# EAGLE design R202X (EAGLE 6.6.0)
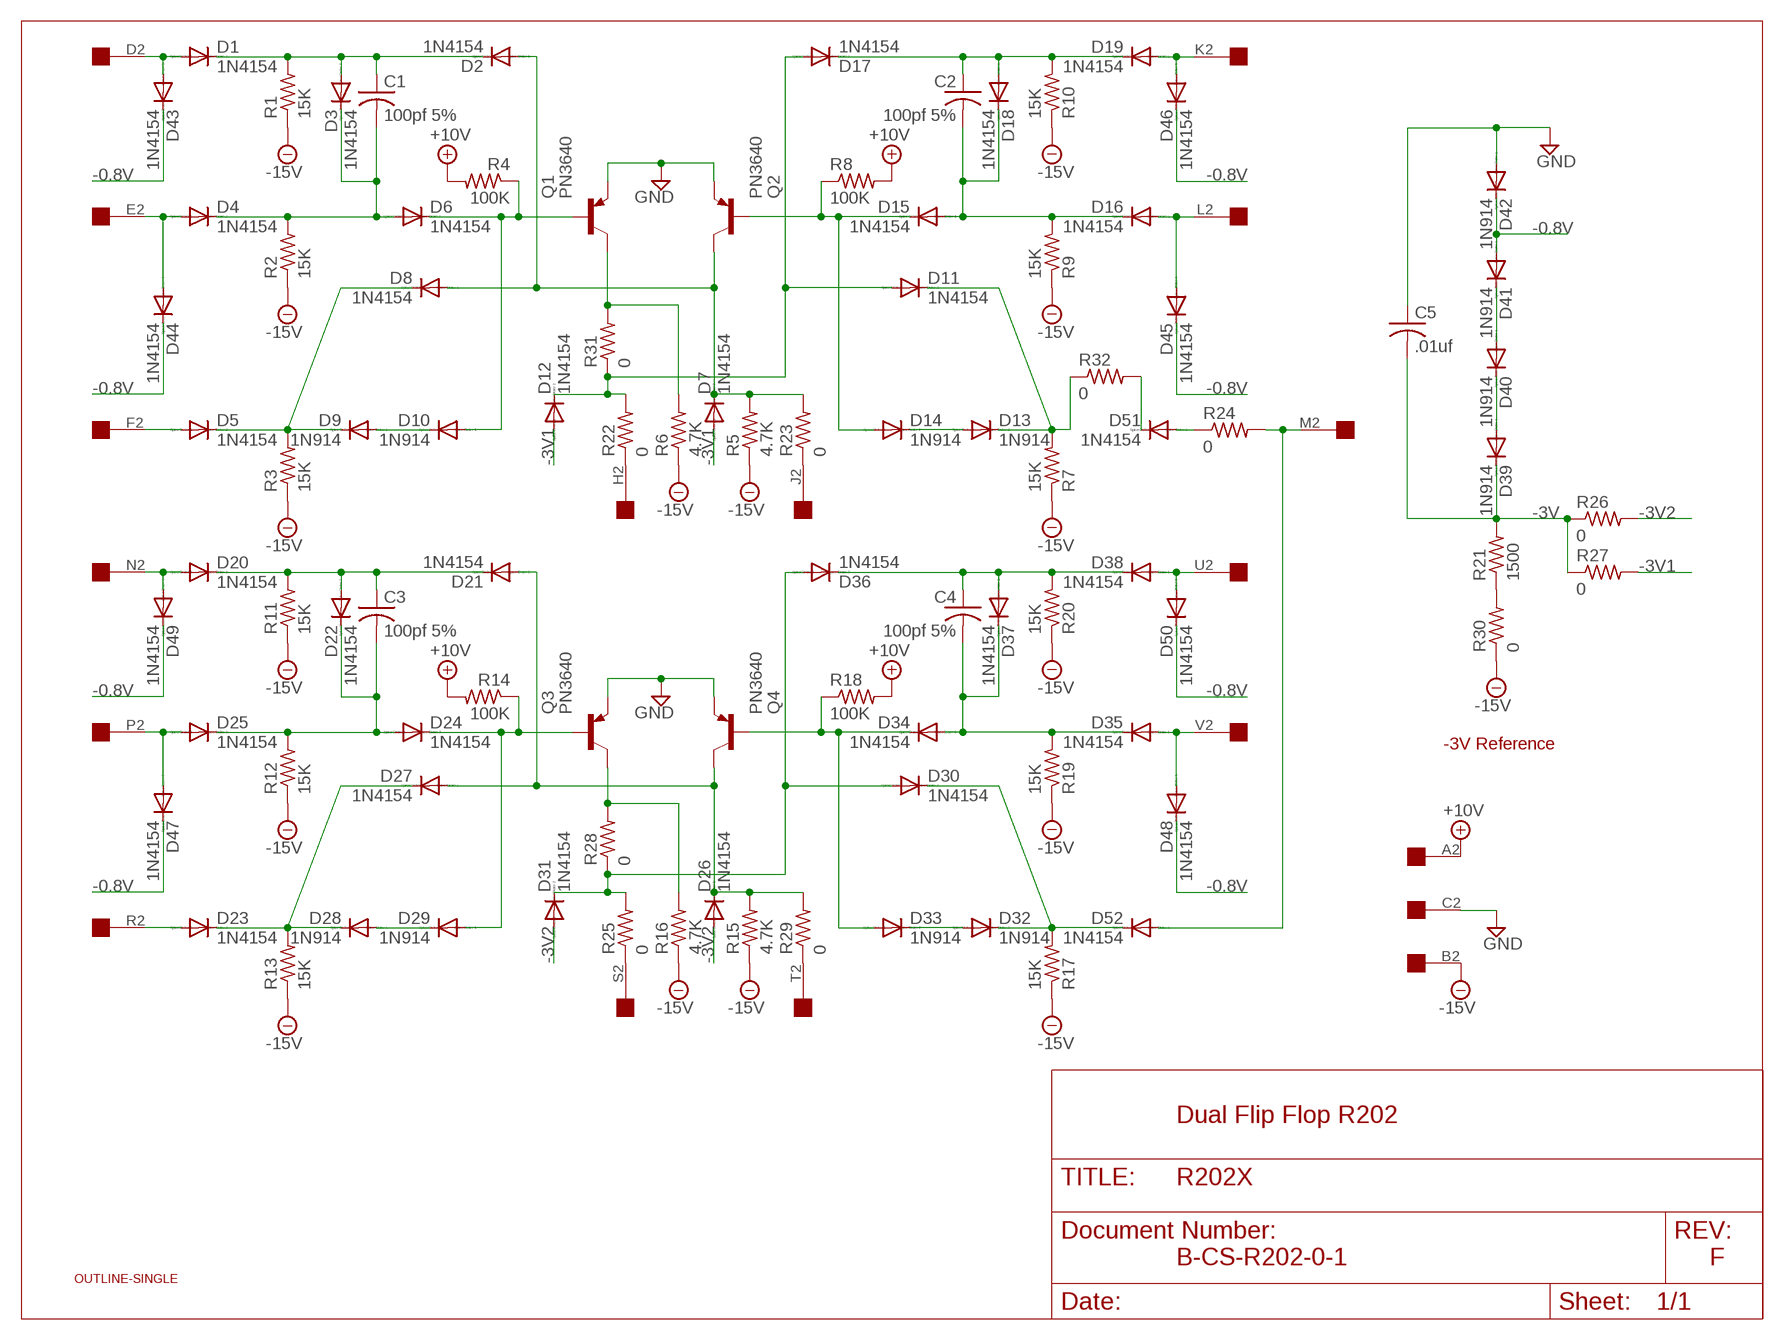
[diagram p0: schematic, sheet 1]

## Parts
C1  100pf 5%  C-US050-025X075  [C050-025X075]
C2  100pf 5%  C-US050-025X075  [C050-025X075]
C3  100pf 5%  C-US050-025X075  [C050-025X075]
C4  100pf 5%  C-US050-025X075  [C050-025X075]
C5  .01uf  C-US050-025X075  [C050-025X075]
D1  1N4154  1N4148DO35-10  [DO35-10]
D2  1N4154  1N4148DO35-10  [DO35-10]
D3  1N4154  1N4148DO35-10  [DO35-10]
D4  1N4154  1N4148DO35-10  [DO35-10]
D5  1N4154  1N4148DO35-10  [DO35-10]
D6  1N4154  1N4148DO35-10  [DO35-10]
D7  1N4154  1N4148DO35-10  [DO35-10]
D8  1N4154  1N4148DO35-10  [DO35-10]
D9  1N914  1N4148DO35-10  [DO35-10]
D10  1N914  1N4148DO35-10  [DO35-10]
D11  1N4154  1N4148DO35-10  [DO35-10]
D12  1N4154  1N4148DO35-10  [DO35-10]
D13  1N914  1N4148DO35-10  [DO35-10]
D14  1N914  1N4148DO35-10  [DO35-10]
D15  1N4154  1N4148DO35-10  [DO35-10]
D16  1N4154  1N4148DO35-10  [DO35-10]
D17  1N4154  1N4148DO35-10  [DO35-10]
D18  1N4154  1N4148DO35-10  [DO35-10]
D19  1N4154  1N4148DO35-10  [DO35-10]
D20  1N4154  1N4148DO35-10  [DO35-10]
D21  1N4154  1N4148DO35-10  [DO35-10]
D22  1N4154  1N4148DO35-10  [DO35-10]
D23  1N4154  1N4148DO35-10  [DO35-10]
D24  1N4154  1N4148DO35-10  [DO35-10]
D25  1N4154  1N4148DO35-10  [DO35-10]
D26  1N4154  1N4148DO35-10  [DO35-10]
D27  1N4154  1N4148DO35-10  [DO35-10]
D28  1N914  1N4148DO35-10  [DO35-10]
D29  1N914  1N4148DO35-10  [DO35-10]
D30  1N4154  1N4148DO35-10  [DO35-10]
D31  1N4154  1N4148DO35-10  [DO35-10]
D32  1N914  1N4148DO35-10  [DO35-10]
D33  1N914  1N4148DO35-10  [DO35-10]
D34  1N4154  1N4148DO35-10  [DO35-10]
D35  1N4154  1N4148DO35-10  [DO35-10]
D36  1N4154  1N4148DO35-10  [DO35-10]
D37  1N4154  1N4148DO35-10  [DO35-10]
D38  1N4154  1N4148DO35-10  [DO35-10]
D39  1N914  1N4148DO35-10  [DO35-10]
D40  1N914  1N4148DO35-10  [DO35-10]
D41  1N914  1N4148DO35-10  [DO35-10]
D42  1N914  1N4148DO35-10  [DO35-10]
D43  1N4154  1N4148DO35-10  [DO35-10]
D44  1N4154  1N4148DO35-10  [DO35-10]
D45  1N4154  1N4148DO35-10  [DO35-10]
D46  1N4154  1N4148DO35-10  [DO35-10]
D47  1N4154  1N4148DO35-10  [DO35-10]
D48  1N4154  1N4148DO35-10  [DO35-10]
D49  1N4154  1N4148DO35-10  [DO35-10]
D50  1N4154  1N4148DO35-10  [DO35-10]
D51  1N4154  1N4148DO35-10  [DO35-10]
D52  1N4154  1N4148DO35-10  [DO35-10]
Q1  PN3640  2N3637  [TO39]
Q2  PN3640  2N3637  [TO39]
Q3  PN3640  2N3637  [TO39]
Q4  PN3640  2N3637  [TO39]
R1  15K  R-US_0207/10  [0207/10]
R2  15K  R-US_0207/10  [0207/10]
R3  15K  R-US_0207/10  [0207/10]
R4  100K  R-US_0207/10  [0207/10]
R5  4.7K  R-US_0207/10  [0207/10]
R6  4.7K  R-US_0207/10  [0207/10]
R7  15K  R-US_0207/10  [0207/10]
R8  100K  R-US_0207/10  [0207/10]
R9  15K  R-US_0207/10  [0207/10]
R10  15K  R-US_0207/10  [0207/10]
R11  15K  R-US_0207/10  [0207/10]
R12  15K  R-US_0207/10  [0207/10]
R13  15K  R-US_0207/10  [0207/10]
R14  100K  R-US_0207/10  [0207/10]
R15  4.7K  R-US_0207/10  [0207/10]
R16  4.7K  R-US_0207/10  [0207/10]
R17  15K  R-US_0207/10  [0207/10]
R18  100K  R-US_0207/10  [0207/10]
R19  15K  R-US_0207/10  [0207/10]
R20  15K  R-US_0207/10  [0207/10]
R21  1500  R-US_0207/10  [0207/10]
R22  0  R-US_0207/10  [0207/10]
R23  0  R-US_0207/10  [0207/10]
R24  0  R-US_0207/10  [0207/10]
R25  0  R-US_0207/10  [0207/10]
R26  0  R-US_0207/10  [0207/10]
R27  0  R-US_0207/10  [0207/10]
R28  0  R-US_0207/10  [0207/10]
R29  0  R-US_0207/10  [0207/10]
R30  0  R-US_0207/10  [0207/10]
R31  0  R-US_0207/10  [0207/10]
R32  0  R-US_0207/10  [0207/10]
U$1  OUTLINE-SINGLE  [SINGLE]
U$2  EDGE-1  [EDGE-CON1]

## Nets
+10V [Power]: R4.2 R8.2 R14.2 R18.2 U$2.A2
-0.8V: D41.A D42.C D43.C D44.C D45.C D46.C D47.C D48.C D49.C D50.C
-3V [Power]: C5.2 D39.C R21.2 R26.1 R27.1
-3V1: D7.A D12.A R27.2
-3V2: D26.A D31.A R26.2
-15V [Power]: R1.1 R2.1 R3.1 R5.1 R6.1 R7.1 R9.1 R10.1 R11.1 R12.1 R13.1 R15.1 R16.1 R17.1 R19.1 R20.1 R30.1 U$2.B2
GND [Power]: C5.1 D42.A Q1.1(E) Q2.1(E) Q3.1(E) Q4.1(E) U$2.C2
H: D11.A D12.C D17.A R22.2 R31.1
J: D2.A D7.C D8.A Q2.3(C) R5.2 R23.2
N$1: Q3.3(C) R16.2 R28.2
N$2: C2.1 D17.C D18.A D19.C R10.2
N$3: C1.2 D3.C D4.C D6.A R2.2
N$4: D1.A D43.A U$2.D2
N$5: D4.A D44.A U$2.E2
N$6: D13.A D14.C
N$7: D19.A D46.A U$2.K2
N$8: C2.2 D15.A D16.C D18.C R9.2
N$9: D5.C D8.C D9.C R3.2
N$10: D5.A U$2.F2
N$11: D16.A D45.A U$2.L2
N$12: D11.C D13.C R7.2 R32.1
N$13: D40.A D41.C
N$14: D6.C D10.A Q1.2(B) R4.1
N$15: D52.A R24.2 U$2.M2
N$16: D39.A D40.C
N$17: D14.A D15.C Q2.2(B) R8.1
N$18: C3.1 D20.C D21.C D22.A R11.2
N$19: D28.A D29.C
N$20: D20.A D49.A U$2.N2
N$21: C3.2 D22.C D24.A D25.C R12.2
N$22: C1.1 D1.C D2.C D3.A R1.2
N$23: D9.A D10.C
N$24: D25.A D47.A U$2.P2
N$25: D23.C D27.C D28.C R13.2
N$26: D23.A U$2.R2
N$27: D24.C D29.A Q3.2(B) R14.1
N$28: C4.1 D36.C D37.A D38.C R20.2
N$29: D32.A D33.C
N$30: D38.A D50.A U$2.U2
N$31: C4.2 D34.A D35.C D37.C R19.2
N$32: D35.A D48.A U$2.V2
N$33: R22.1 U$2.H2
N$34: D33.A D34.C Q4.2(B) R18.1
N$35: D30.C D32.C D52.C R17.2
N$36: R23.1 U$2.J2
N$37: D51.A R24.1
N$38: R25.1 U$2.S2
N$39: R29.1 U$2.T2
N$40 [Power]: R21.1 R30.2
N$41: Q1.3(C) R6.2 R31.2
N$42: D51.C R32.2
S: D30.A D31.C D36.A R25.2 R28.1
T: D21.A D26.C D27.A Q4.3(C) R15.2 R29.2

## Notes on the sheet
- -3V Reference
- Dual Flip Flop R202
- B-CS-R202-0-1 | F

## Library data of the parts
C1-C5 = rcl:C-US: CAPACITOR, American symbol
D1-D52 = diode:1N4148: DIODE high speed (Philips)
Q1-Q4 = transistor-pnp:2N3637*: PNP Transistror
R1-R32 = rcl:R-US_: RESISTOR, American symbol
U$1 = dec-con:OUTLINE-*: Board outlines for DEC boards.
U$2 = dec-con:EDGE-1: Single-Sided DEC Edge Connector -- (side 2)

## Net classes
1 Power: width 0.813 mm

## Board
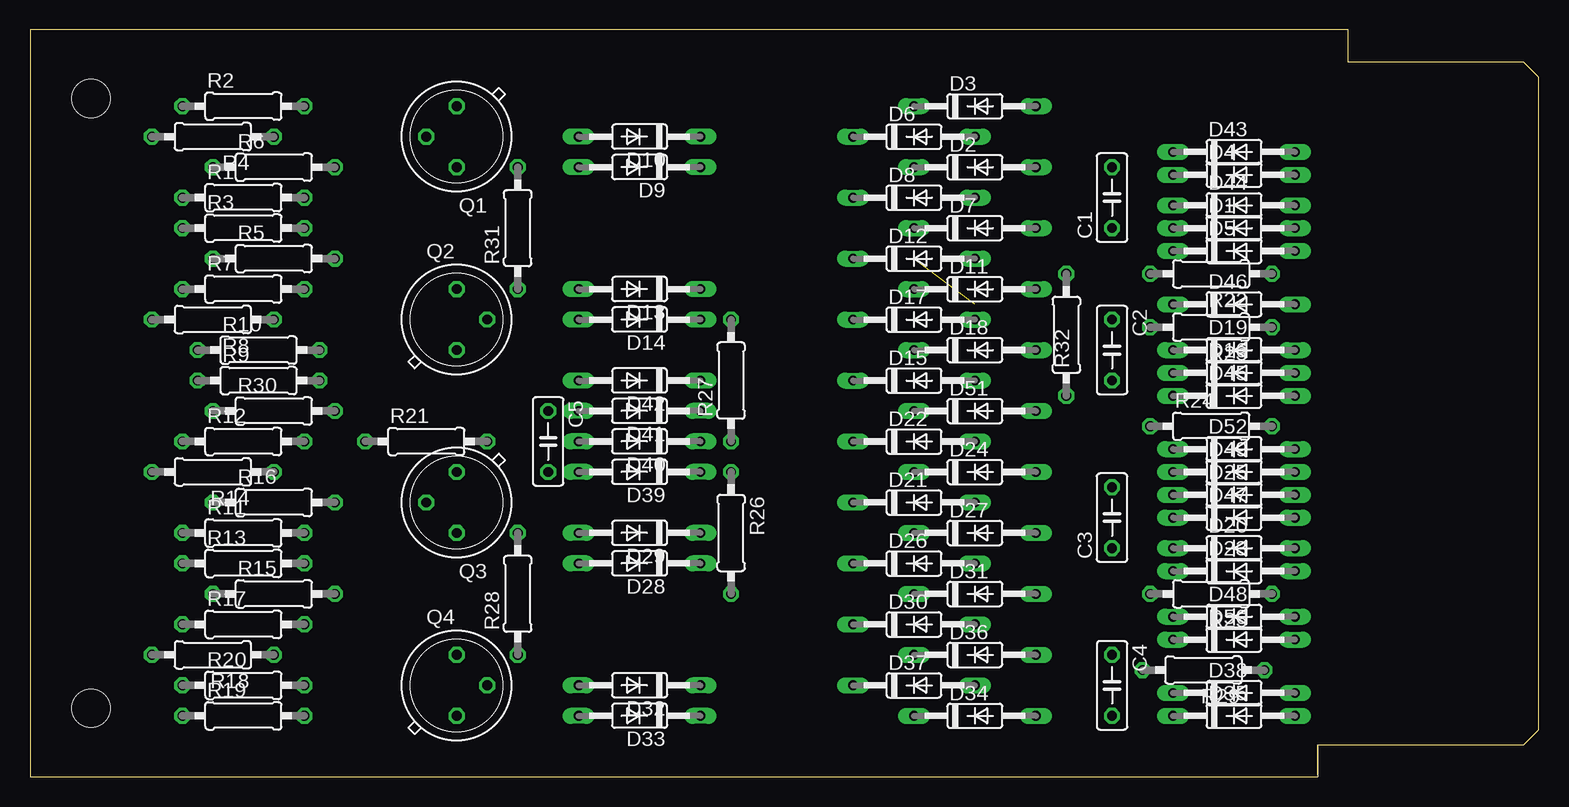
[diagram p1: board, top side]
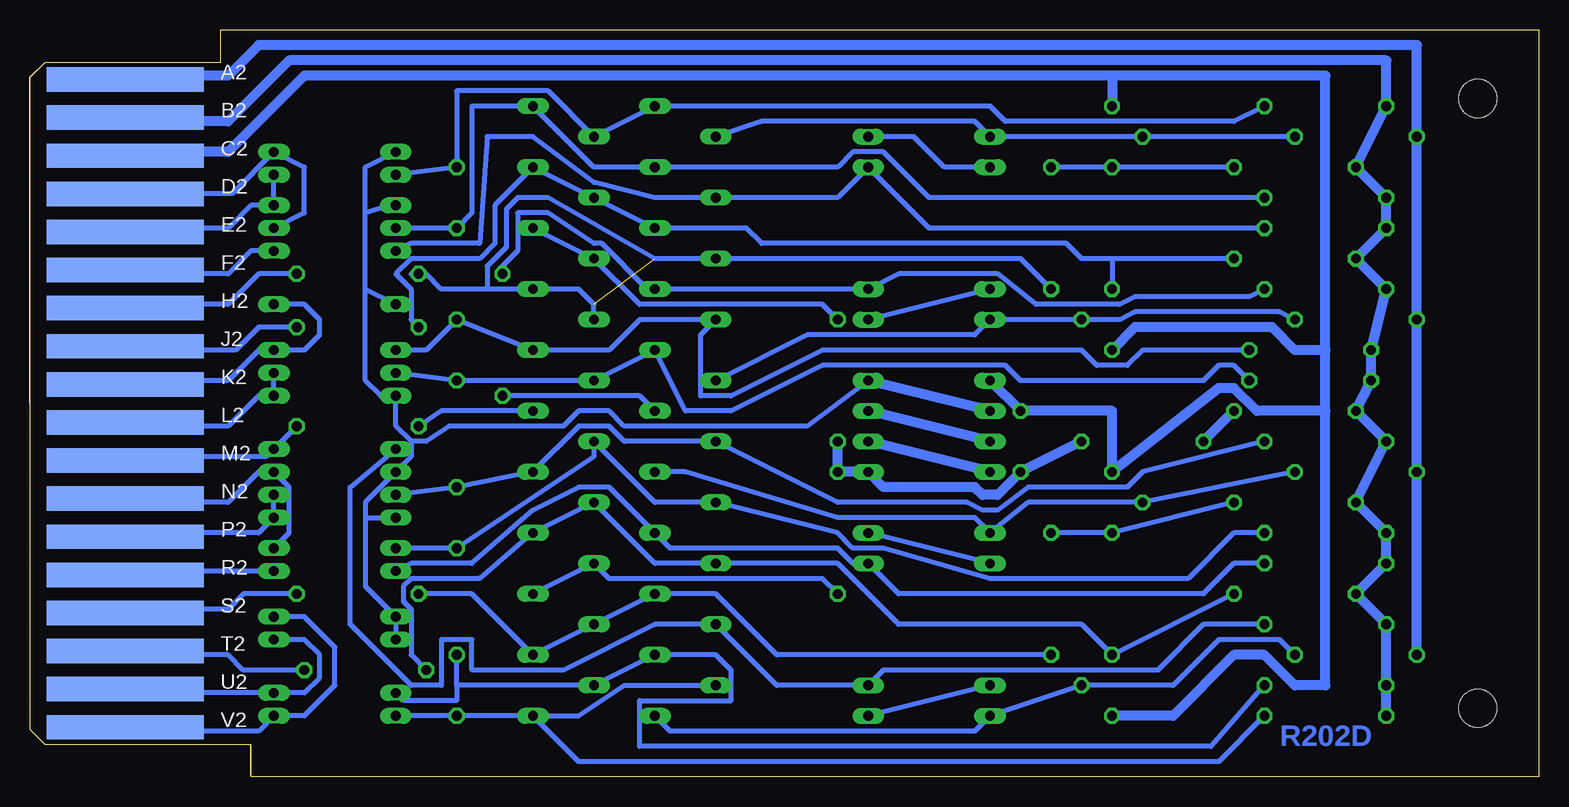
[diagram p2: board, bottom side, seen from below]

Size 125.73 x 62.23 mm. Coordinates in mm from the lower left corner, seen from the top.
Copper layers (1+16): Top 0.035mm / dielectric 1.5mm / Bottom 0.035mm
Design rules "16mils": minimum track width 16mil, minimum drill 32mil, track to track 15mil, track to pad 10mil, pad to pad 10mil, via to via 10mil, smd to smd 10mil, copper to edge 13mil, drill to drill 10mil, minimum pad ring 10mil, minimum via ring 8mil, stop-mask expansion 0mil, vias tented up to drill 0mil, thermal gap 10mil

### Footprints (pad centres in the part's own frame; a part is rotated, then mirrored left to right if it is on the bottom)
C050-025X075 = drill 0.813 octagon: 1 -2.54,0; 2 2.54,0
DO35-10 = drill 0.813 long: A 5.08,0; C -5.08,0
TO39 = drill 0.813 octagon: 1 0,-2.54; 2 2.54,0; 3 0,2.54
0207/10 = drill 0.813 octagon: 1 -5.08,0; 2 5.08,0
SINGLE = hole 3.175: 120.65,56.515; 120.65,5.715
EDGE-CON1 = smd 13.106 x 2.032 bottom: A2 7.938,4.128; B2 7.938,7.303; C2 7.938,10.477; D2 7.938,13.652; E2 7.938,16.828; F2 7.938,20.003; H2 7.938,23.177; J2 7.938,26.352; K2 7.938,29.527; L2 7.938,32.703; M2 7.938,35.877; N2 7.938,39.053; P2 7.938,42.227; R2 7.938,45.403; S2 7.938,48.578; T2 7.938,51.752; U2 7.938,54.928; V2 7.938,58.102

### Placement (x,y rotation side)
C1  90.17,48.26 90 top
C2  90.17,35.56 270 top
C3  90.17,21.59 90 top
C4  90.17,7.62 270 top
C5  43.18,27.94 270 top
D1  100.33,45.72 0 top
D2  78.74,50.8 0 top
D3  78.74,55.88 0 top
D4  100.33,50.16 0 top
D5  100.33,43.81 0 top
D6  73.66,53.34 0 top
D7  78.74,45.72 0 top
D8  73.66,48.26 0 top
D9  50.8,50.8 180 top
D10  50.8,53.34 180 top
D11  78.74,40.64 0 top
D12  73.66,43.18 0 top
D13  50.8,40.64 180 top
D14  50.8,38.1 180 top
D15  73.66,33.02 0 top
D16  100.33,33.66 0 top
D17  73.66,38.1 0 top
D18  78.74,35.56 0 top
D19  100.33,35.56 0 top
D20  100.33,19.05 0 top
D21  73.66,22.86 0 top
D22  73.66,27.94 0 top
D23  100.33,17.14 0 top
D24  78.74,25.4 0 top
D25  100.33,23.5 0 top
D26  73.66,17.78 0 top
D27  78.74,20.32 0 top
D28  50.8,17.78 180 top
D29  50.8,20.32 180 top
D30  73.66,12.7 0 top
D31  78.74,15.24 0 top
D32  50.8,7.62 180 top
D33  50.8,5.08 180 top
D34  78.74,5.08 0 top
D35  100.33,5.08 0 top
D36  78.74,10.16 0 top
D37  73.66,7.62 0 top
D38  100.33,6.99 0 top
D39  50.8,25.4 180 top
D40  50.8,27.94 180 top
D41  50.8,30.48 180 top
D42  50.8,33.02 180 top
D43  100.33,52.07 0 top
D44  100.33,47.62 0 top
D45  100.33,31.75 0 top
D46  100.33,39.37 0 top
D47  100.33,21.59 0 top
D48  100.33,13.34 0 top
D49  100.33,25.4 0 top
D50  100.33,11.43 0 top
D51  78.74,30.48 0 top
D52  100.33,27.3 0 top
Q1  35.56,53.34 180 top
Q2  35.56,38.1 0 top
Q3  35.56,22.86 180 top
Q4  35.56,7.62 0 top
R1  17.78,48.26 0 top
R2  17.78,55.88 0 top
R3  17.78,45.72 0 top
R4  15.24,53.34 180 top
R5  20.32,43.18 0 top
R6  20.32,50.8 0 top
R7  17.78,40.64 0 top
R8  15.24,38.1 180 top
R9  19.05,33.02 0 top
R10  19.05,35.56 0 top
R11  17.78,20.32 0 top
R12  17.78,27.94 0 top
R13  17.78,17.78 0 top
R14  15.24,25.4 180 top
R15  20.32,15.24 0 top
R16  20.32,22.86 0 top
R17  17.78,12.7 0 top
R18  15.24,10.16 180 top
R19  17.78,5.08 0 top
R20  17.78,7.62 0 top
R21  33.02,27.94 0 top
R22  98.42,41.91 180 top
R23  98.42,37.47 180 top
R24  98.42,29.21 0 top
R25  98.42,15.24 180 top
R26  58.42,20.32 270 top
R27  58.42,33.02 90 top
R28  40.64,15.24 90 top
R29  97.79,8.89 180 top
R30  20.32,30.48 0 top
R31  40.64,45.72 90 top
R32  86.36,36.83 270 top
U$1  125.73,62.23 180 top
U$2  125.73,62.23 180 top

### Tracks (layer width: path | path; a pad name or v marks a point on that pad's centre or on a via)
+10V
  Bottom 0.813: R18.2 R14.2 R8.2 R4.2 10.16,60.96 106.68,60.96 109.22,58.42 117.66,58.42 U$2.A2
-0.8V
  Bottom 0.406: D43.C 97.79,50.8 97.79,46.99 | 97.79,40.64 97.79,46.99 | 97.79,40.64 D46.C | D44.C 95.89,47.62 97.79,46.99 | 97.79,40.64 97.79,33.02 96.52,31.75 D45.C 95.25,29.21 93.98,27.94 | 93.98,27.94 93.98,26.67 D49.C 97.79,22.86 97.79,21.59 | 97.79,21.59 97.79,15.88 D48.C D50.C | 97.79,21.59 D47.C | D42.C 60.96,29.21 76.2,29.21 77.47,30.48 80.01,30.48 81.28,29.21 90.81,29.21 92.71,27.94 93.98,27.94
  Bottom 0.813: D41.A D42.C
-3V
  Bottom 0.813: R21.2 C5.2 45.09,23.5 46.35,23.5 46.99,24.13 54.61,24.13 D39.C R26.1 R27.1
-3V1
  Bottom 0.406: D7.A D12.A 74.93,39.37 59.69,39.37 R27.2
-3V2
  Bottom 0.406: R26.2 59.69,16.51 77.47,16.51 D26.A D31.A
-15V
  Bottom 0.813: R19.1 R20.1 R17.1 R15.1 R13.1 R11.1 R16.1 R12.1 R30.1 R9.1 R10.1 R7.1 R5.1 R3.1 R1.1 R6.1 R2.1 12.7,59.69 104.14,59.69 109.22,54.61 111.76,54.61 U$2.B2
GND
  Bottom 0.813: U$2.C2 111.76,52.07 109.22,52.07 102.87,58.42 35.56,58.42 | 35.56,58.42 Q1.1 | 35.56,58.42 17.78,58.42 17.78,35.56 | 17.78,30.48 17.78,7.62 20.32,7.62 22.86,10.16 25.4,10.16 30.48,5.08 Q4.1 | 17.78,30.48 17.78,35.56 | D42.A C5.1 35.56,30.48 Q3.1 26.67,32.38 25.4,32.38 23.5,30.48 17.78,30.48 | Q2.1 33.66,37.47 22.23,37.47 20.32,35.56 17.78,35.56
H  (1 unrouted)
  Bottom 0.406: R31.1 43.18,43.18 D12.C 73.66,43.18 82.55,48.26 85.09,48.26 86.04,47.31 86.04,44.13 87.63,42.55 87.63,40.64 | 93.98,41.91 R22.2 92.71,41.91 91.44,40.64 87.63,40.64 | D17.A 78.74,39.37 80.01,40.64 D11.A 87.63,40.64
J
  Bottom 0.406: R5.2 35.56,43.18 | 35.56,43.18 38.1,43.18 39.37,44.45 64.77,44.45 66.04,45.72 D7.C D8.A D2.A 87,47.62 87,44.45 88.27,43.18 93.98,43.18 95.25,41.91 93.98,40.64 93.98,38.1 R23.2 | 35.56,43.18 Q2.3
N$1
  Bottom 0.406: R16.2 Q3.3 R28.2
N$2
  Bottom 0.406: R10.2 33.02,35.56 34.29,34.29 36.83,34.29 38.1,35.56 59.69,35.56 67.31,31.75 69.85,31.75 69.85,36.83 D17.C 74.93,38.1 77.47,35.56 D18.A C2.1 92.71,35.56 D19.C
N$3
  Bottom 0.406: R2.2 25.4,54.61 44.45,54.61 45.72,55.88 D3.C D6.A 82.55,57.15 90.17,57.15 C1.2 D4.C
N$4
  Bottom 0.406: U$2.D2 111.76,48.59 108.89,48.59 D43.A 102.87,50.8 102.87,46.99 D1.A
N$5
  Bottom 0.406: U$2.E2 112.06,45.41 111.76,45.72 109.22,45.72 107.31,47.62 D44.A D4.A
N$6
  Bottom 0.406: D13.A D14.C
N$7
  Bottom 0.406: U$2.K2 112.09,33.33 112.06,33.33 111.76,33.02 109.22,33.02 106.68,35.56 D19.A 102.87,35.56 101.6,36.83 101.6,38.1 102.87,39.37 D46.A
N$8
  Bottom 0.406: R9.2 25.4,34.29 26.67,34.29 27.94,33.02 43.18,33.02 44.45,34.29 59.69,34.29 67.31,30.48 71.12,30.48 D18.C D15.A C2.2 D16.C
N$9
  Bottom 0.406: R3.2 50.8,45.72 D9.C 58.42,48.26 D8.C 73.66,48.26 78.74,49.53 83.82,53.34 87.63,53.34 88.27,44.45 93.98,44.45 D5.C
N$10
  Bottom 0.406: U$2.F2 112.12,42.27 111.76,41.91 109.22,41.91 107.31,43.81 D5.A
N$11
  Bottom 0.406: U$2.L2 112.7,30.15 111.76,29.21 109.22,29.21 106.68,31.75 D45.A D16.A
N$12
  Bottom 0.406: R7.2 24.13,40.01 33.66,40.01 34.92,39.37 41.91,39.37 45.09,41.91 53.34,41.91 D13.C D11.C 74.3,40.64 78.11,44.45 78.74,44.45 82.55,46.99 85.09,46.99 85.09,43.81 86.36,42.55 R32.1
N$13
  Bottom 0.813: D40.A D41.C
N$14
  Bottom 0.406: R4.1 Q1.2 D10.A 46.99,54.61 64.77,54.61 D6.C
N$15
  Bottom 0.406: U$2.M2 112.7,25.73 111.76,26.67 106.05,26.67 D52.A R24.2
N$16
  Bottom 0.813: D39.A D40.C
N$17
  Bottom 0.406: R8.1 21.59,38.73 33.66,38.73 34.92,38.1 Q2.2 D14.A 46.99,36.83 60.96,36.83 D15.C
N$18
  Bottom 0.406: R11.2 25.4,20.32 29.21,16.51 45.72,16.51 54.61,19.05 57.15,19.05 58.42,20.32 D21.C 73.66,22.86 D22.A 78.74,26.67 C3.1 D20.C
N$19
  Bottom 0.406: D28.A D29.C
N$20
  Bottom 0.406: U$2.N2 112.7,23.8 111.76,22.86 109.22,22.86 106.68,25.4 D49.A 104.14,24.13 104.14,20.32 D20.A
N$21
  Bottom 0.406: R12.2 33.02,25.4 34.29,24.13 42.55,24.13 45.09,22.23 46.35,22.23 47.62,22.86 58.42,22.86 D22.C 76.2,27.94 77.47,29.21 80.01,29.21 D24.A C3.2 D25.C
N$22
  Bottom 0.406: R1.2 50.8,48.26 54.61,52.07 57.15,52.07 58.42,50.8 D2.C 78.74,50.8 D3.A 88.9,55.88 88.9,46.99 C1.1 D1.C
N$23
  Bottom 0.406: D9.A 49.53,50.8 52.07,53.34 D10.C
N$24
  Bottom 0.406: U$2.P2 112.7,19.38 111.76,20.32 106.68,20.32 D47.A D25.A
N$25
  Bottom 0.406: R13.2 25.4,17.78 27.94,15.24 53.34,15.24 D28.C 57.15,17.78 58.42,19.05 72.39,19.05 D27.C 77.47,24.13 80.01,24.13 83.82,22.23 88.9,17.78 93.98,17.78 D23.C
N$26
  Bottom 0.406: U$2.R2 112.7,17.45 112.39,17.14 D23.A
N$27
  Bottom 0.406: R14.1 Q3.2 42.55,22.86 D29.A 46.99,21.59 58.42,21.59 71.12,25.4 D24.C
N$28
  Bottom 0.406: R20.2 27.3,2.54 74.93,2.54 74.93,6.35 67.31,6.35 67.31,8.89 68.58,10.16 D36.C D37.A 90.17,7.62 | D38.C 94.61,6.35 90.17,6.35 90.17,7.62 | 90.17,7.62 C4.1
N$29
  Bottom 0.406: D32.A D33.C
N$30
  Bottom 0.406: U$2.U2 112.75,6.71 112.67,6.71 112.39,6.99 D38.A 102.87,6.99 101.6,8.26 101.6,10.16 102.87,11.43 D50.A
N$31
  Bottom 0.406: R19.2 26.67,1.27 80.01,1.27 D34.A | D34.A 80.01,5.08 76.2,7.62 D37.C | D35.C C4.2 D34.A
N$32
  Bottom 0.406: U$2.V2 112.71,4.76 111.76,3.81 106.68,3.81 D35.A 102.87,5.08 100.33,7.62 100.33,10.79 102.87,13.34 D48.A
N$33
  Bottom 0.406: U$2.H2 112.06,39.06 111.76,39.37 109.22,39.37 106.68,41.91 R22.1
N$34
  Bottom 0.406: R18.1 21.59,11.43 26.67,11.43 30.48,7.62 Q4.2 D33.A 46.99,3.81 72.39,3.81 D34.C
N$35
  Bottom 0.406: R17.2 27.94,12.7 31.75,8.89 54.61,8.89 D32.C 63.5,7.62 D30.C 73.66,12.7 81.28,8.89 88.9,8.89 88.9,11.43 91.44,11.43 91.44,7.62 93.98,7.62 99.06,12.7 99.06,24.13 D52.C
N$36
  Bottom 0.406: U$2.J2 112.7,36.5 111.76,35.56 108.58,35.56 106.68,37.47 R23.1
N$37
  Bottom 0.406: D51.A 91.44,30.48 R24.1
N$38
  Bottom 0.406: U$2.S2 112.09,14.28 112.06,14.28 111.76,13.97 109.22,13.97 107.95,15.24 R25.1
N$39
  Bottom 0.406: U$2.T2 112.7,11.1 111.76,10.16 109.22,10.16 107.95,8.89 R29.1
N$40
  Bottom 0.813: R30.2 R21.1
N$41
  Bottom 0.406: R6.2 Q1.3 R31.2
N$42
  Bottom 0.406: D51.C 74.93,31.75 R32.2
S
  Bottom 0.406: R28.1 63.5,10.16 68.58,15.24 D31.C D30.A D36.A 88.9,15.24 R25.2
T
  Bottom 0.406: R15.2 Q4.3 38.1,12.7 53.34,12.7 58.42,17.78 D26.C 73.66,17.78 D21.A D27.A 88.27,16.51 93.98,16.51 94.61,15.88 94.61,14.61 93.98,13.97 93.98,10.16 R29.2

### Text on the board
Bottom: R202D